# Altium schematic sheet Schematics.SchDoc: EyeGAIT Schematics
size A4; Author: Pedro Trenado & Ignacio Cabrera; CompanyName: ETSI Telecomunicaciones; DrawnBy: Pedro & Ignacio; Organization: UPM; DocumentNumber: 1; Revision: 1.0; SheetNumber: 1; Company: ETSI Telecomunicaciones; Address_City: Madrid; Address_Country: Spain; Address_Phone: 910 67 19 00; Address_State_ZIP: 28040; Address_Street: Av. Complutense, 30; TotalSheet: 5; VersionRevision: 1.0; Address_Website: https://www.etsist.upm.es; License: Student
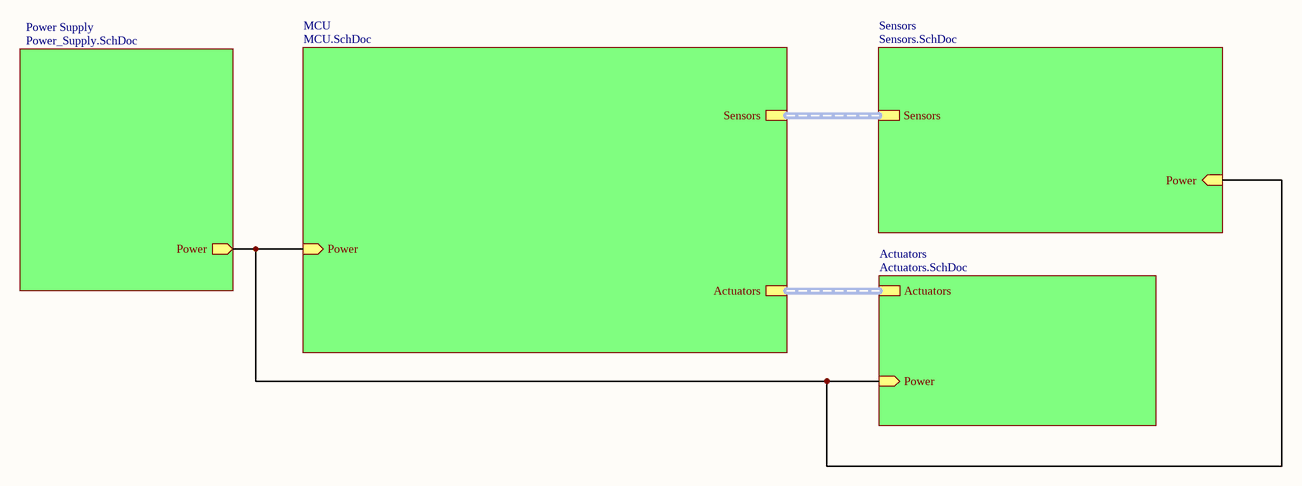
[diagram p0: Schematics.SchDoc]

## Sub-sheets
Actuators = Actuators.SchDoc: Actuators (harness IO Actuators), Power (in)
MCU = MCU.SchDoc: Sensors (harness IO Sensors), Power (in), Actuators (harness IO Actuators)
Power Supply = Power_Supply.SchDoc: Power (out)
Sensors = Sensors.SchDoc: Sensors (harness IO Sensors), Power (in)

## Nets
(unnamed): sheet Sensors/Power, sheet MCU/Power, sheet Actuators/Power, sheet Power Supply/Power

## Buses and harness runs
harness sheet Actuators/Actuators = sheet MCU/Actuators
harness sheet MCU/Sensors = sheet Sensors/Sensors

## Notes on the sheet
- Title:
- Drawn By:
- Page Contents:
- Checked By:
- Size:
- Date:
- File:
- License:
- Email:
- A4
- Number:
- Time:
- Revision:
- Sheet
- Website:
- of